# Altium schematic sheet Steering Wheel Steering Stalk Connector.SchDoc: Steering Wheel - Steering Stalk Connector
size B; Organization: Midnight Sun Solar Rayce Car Team; Address1: University of Waterloo; Address2: 200 University Ave W; Address3: Waterloo, ON, Canada; Address4: N2L 3E9; DocumentNumber: 1; SheetNumber: 2; SheetTotal: 5; Website: www.uwmidsun.com; ProjectName: ProjectName
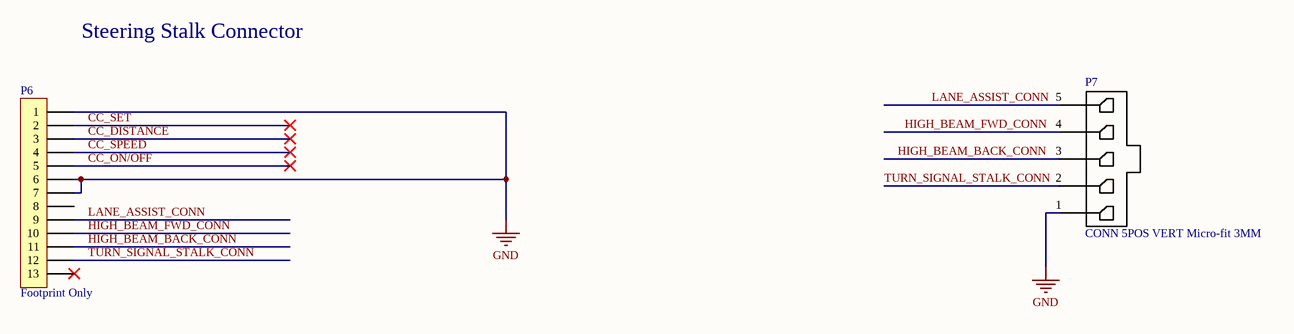
[diagram p0: Steering Wheel Steering Stalk Connector.SchDoc]

## Parts
P6  Footprint Only  [CONN 13POS CARD EDGE]  (no BOM)
P7  CONN 5POS VERT Micro-fit 3MM  [CONN, 5POS MICRO-FIT 3mm]

## Nets
GND: P6.1 P6.6 P6.7 P7.1
CC_DISTANCE: P6.3
CC_ON/~{OFF}: P6.5
CC_SET: P6.2
CC_SPEED: P6.4
HIGH_BEAM_BACK_CONN: P6.11 P7.3
HIGH_BEAM_FWD_CONN: P6.10 P7.4
LANE_ASSIST_CONN: P6.9 P7.5
TURN_SIGNAL_STALK_CONN: P6.12 P7.2

Not connected (* = marked no-connect by the designer): P6 8 13*

## Notes on the sheet
- Steering Stalk Connector
- PROJECT
- DOCUMENT
- DRAWN BY
- LAST MODIFIED
- PART NUMBER
- REVISION
- SHEET
- VARIANT
- OF
- Engineering 5 - 1002
  University of Waterloo
  (519) 888-4567 x32978
  hardware@uwmidsun.com

## Library data of the parts
P6 = CONN 13POS 0.1" CARD EDGE
P7 = CMP-022-0000-1: Conn Power HDR 5 POS 3mm Solder ST Thru-Hole 5 Terminal 1 Port Micro-Fit 3.0™ Tray; Manufacturer Part Number: 0436500516; Manufacturer: Molex; Max Voltage Rating (AC): 250V; Connector Type: Male Pin; Number of Contacts: 5; Number of Ports: 1; Min Operating Temperature: -40°C; Source: SchlibSolarSense.SchLib; Design Item ID: CONN 5POS VERT Micro-fit 3MM; Number of Terminals: 5; Stock 1: 1615; Orientation: Straight; Contact Plating: Gold; Contact Material: Brass; Number of Rows: 1; Fastening Type: Ramp; Max Operating Temperature: 105°C; Termination: Solder; Mount: Through Hole; ComponentLink1URL: https://datasheet.ciiva.com/6813/436500516-sd-6813986.pdf?src-supplier=Digi-Key; Color: Black; Length: 18.65mm; ComponentLink1Description: https://datasheet.ciiva.com/6813/436500516-sd-6813986.pdf?src-supplier=Digi-Key; Number of Positions: 5; ComponentLink2URL: https://datasheet.ciiva.com/3943/304280436500516-pcb-headers-3943315.pdf?src-supplier=Arrow; Packaging: Tray; Pitch: 3mm; Housing Material: Polymer; RoHS: Yes; ComponentLink2Description: https://datasheet.ciiva.com/3943/304280436500516-pcb-headers-3943315.pdf?src-supplier=Arrow; Pricing 1: 1=1.52000, 10=1.38200, 100=1.18480, 500=0.98736, 1000=0.84630, 5000=0.75039, 10000=0.73346 (USD); Depth: 5.57mm